# EAGLE design card_base (EAGLE 8.7.1)
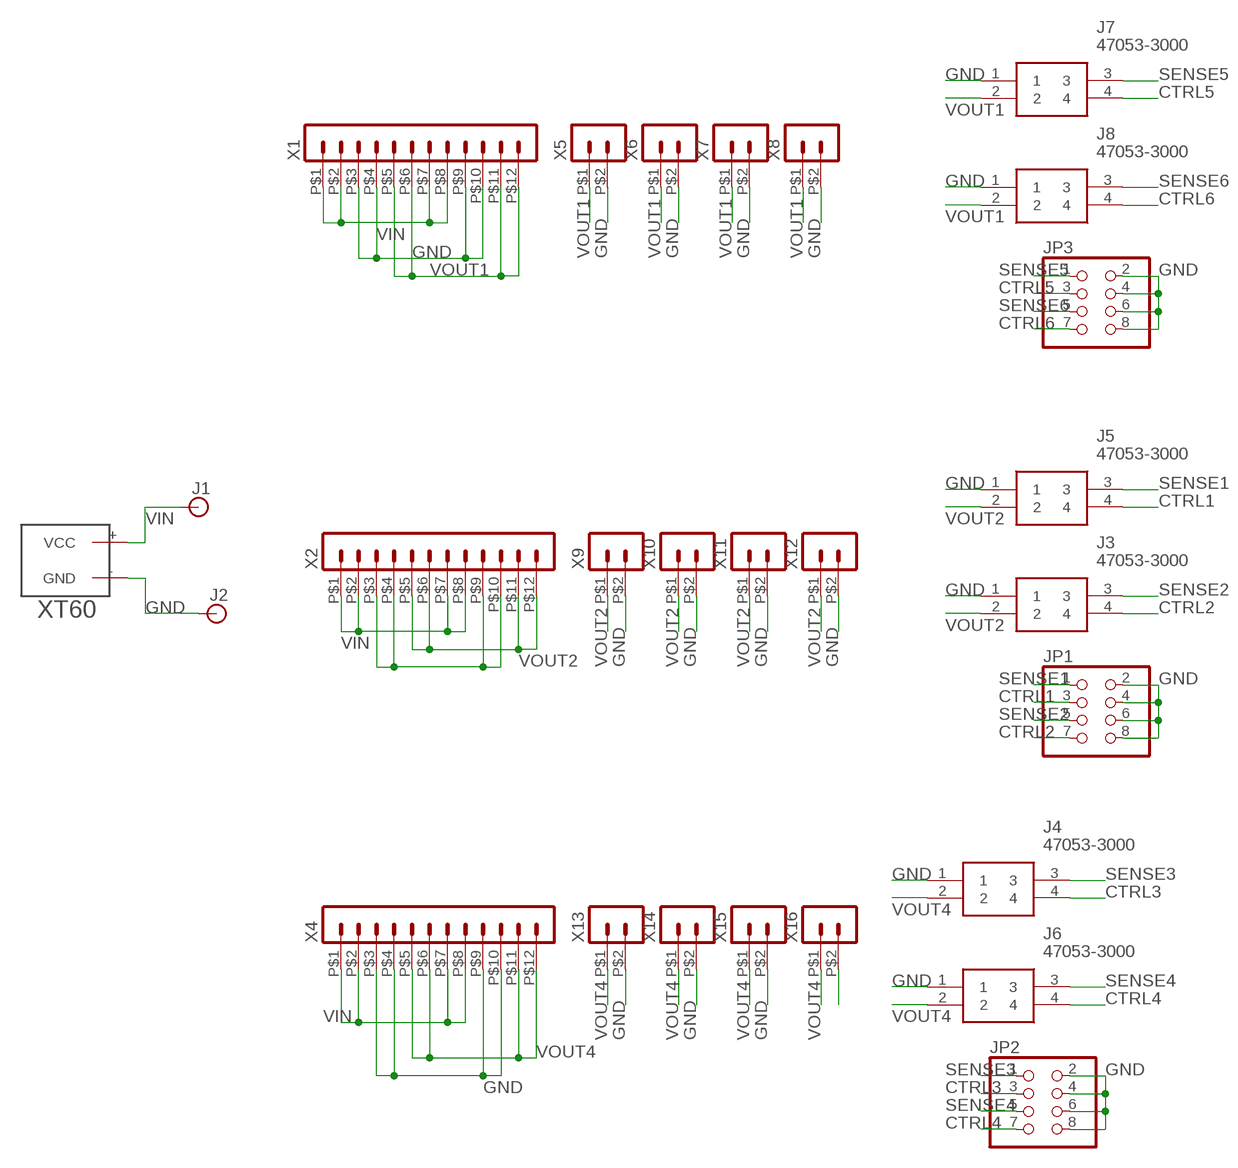
[diagram p0: schematic, sheet 1]

## Parts
J1  BANANA_CONN  [BANANA_CONN]
J2  BANANA_CONN  [BANANA_CONN]
J3  47053-3000  [470533000]
J4  47053-3000  [470533000]
J5  47053-3000  [470533000]
J6  47053-3000  [470533000]
J7  47053-3000  [470533000]
J8  47053-3000  [470533000]
JP1  PINHD-2X4  [2X04]
JP2  PINHD-2X4  [2X04]
JP3  PINHD-2X4  [2X04]
U$1  XT60  [XT60]
X1  HEADER_POS12_44432-1201  [44432-1201]
X2  HEADER_POS12_44432-1201  [44432-1201]
X4  HEADER_POS12_44432-1201  [44432-1201]
X5  HEADER_POS2_44914-0201  [44914-0201]
X6  HEADER_POS2_44914-0201  [44914-0201]
X7  HEADER_POS2_44914-0201  [44914-0201]
X8  HEADER_POS2_44914-0201  [44914-0201]
X9  HEADER_POS2_44914-0201  [44914-0201]
X10  HEADER_POS2_44914-0201  [44914-0201]
X11  HEADER_POS2_44914-0201  [44914-0201]
X12  HEADER_POS2_44914-0201  [44914-0201]
X13  HEADER_POS2_44914-0201  [44914-0201]
X14  HEADER_POS2_44914-0201  [44914-0201]
X15  HEADER_POS2_44914-0201  [44914-0201]
X16  HEADER_POS2_44914-0201  [44914-0201]

## Nets
CTRL1: J5.4 JP1.3
CTRL2: J3.4 JP1.7
CTRL3: J4.4 JP2.3
CTRL4: J6.4 JP2.7
CTRL5: J7.4 JP3.3
CTRL6: J8.4 JP3.7
GND: J2.P$1 J3.1 J4.1 J5.1 J6.1 J7.1 J8.1 JP1.2 JP1.4 JP1.6 JP1.8 JP2.2 JP2.4 JP2.6 JP2.8 JP3.2 JP3.4 JP3.6 JP3.8 U$1.-(GND) X1.P$3 X1.P$4 X1.P$9 X1.P$10 X2.P$3 X2.P$4 X2.P$9 X2.P$10 X4.P$3 X4.P$4 X4.P$9 X4.P$10 X5.P$2 X6.P$2 X7.P$2 X8.P$2 X9.P$2 X10.P$2 X11.P$2 X12.P$2 X13.P$2 X14.P$2 X15.P$2 X16.P$2
SENSE1: J5.3 JP1.1
SENSE2: J3.3 JP1.5
SENSE3: J4.3 JP2.1
SENSE4: J6.3 JP2.5
SENSE5: J7.3 JP3.1
SENSE6: J8.3 JP3.5
VIN: J1.P$1 U$1.+(VCC) X1.P$1 X1.P$2 X1.P$7 X1.P$8 X2.P$1 X2.P$2 X2.P$7 X2.P$8 X4.P$1 X4.P$2 X4.P$7 X4.P$8
VOUT1: J7.2 J8.2 X1.P$5 X1.P$6 X1.P$11 X1.P$12 X5.P$1 X6.P$1 X7.P$1 X8.P$1
VOUT2: J3.2 J5.2 X2.P$5 X2.P$6 X2.P$11 X2.P$12 X9.P$1 X10.P$1 X11.P$1 X12.P$1
VOUT4: J4.2 J6.2 X4.P$5 X4.P$6 X4.P$11 X4.P$12 X13.P$1 X14.P$1 X15.P$1 X16.P$1

## Library data of the parts
J1 J2 = SparkFun-Connectors:BANANA_CONN: Through-hole Banana Jack Basic PTH connection for banana jack plugs SparkFun Products: Multimeter Kit <https://www.sparkfun.com/products/retired/10956> Banana to Alligator Cable <https://www.sparkfun.com/products/retired/509> Banana to Alligator Coax Cable <https://www.sparkfun.com/products/retired/508> Banana to Banana Cable <https://www.sparkfun.com/products/retired/507> Banana to IC Hook Cables <https://www.sparkfun.com/products/retired/506>
J3-J8 = 47053-3000:47053-3000: Headers & Wire Housings 4 PIN HEADER WITH FR R WITH FRICTION LOCK Source: Datasheet <https://www.mouser.com/datasheet/2/276/0470533000_PCB_HEADERS-146177.pdf>; ALLIED_NUMBER: 71469769; ALLIED_PRICE-STOCK: https://www.alliedelec.com/molexincorporated-47053-3000/71469769/; DESCRIPTION: Headers & Wire Housings 4 PIN HEADER WITH FR R WITH FRICTION LOCK; HEIGHT: 9.84mm; MANUFACTURER_NAME: Molex; MANUFACTURER_PART_NUMBER: 47053-3000; MOUSER_PART_NUMBER: 538-47053-3000; MOUSER_PRICE-STOCK: https://www.mouser.co.uk/ProductDetail/Molex/47053-3000?qs=C09bn3Oxp5WWv2npicpAUw%3D%3D
JP1-JP3 = adafruit:PINHD-2X4: PIN HEADER
U$1 = XT60:XT60: XT60
X1 X2 X4 = con-molex-micro-fit-3_0:HEADER_POS12_?: Molex - Micro-Fit 3.0 Series connector, 3.00mm (0.118") pitch header, 12 positions.
X5-X16 = con-molex-micro-fit-3_0:HEADER_POS2_?: Molex - Micro-Fit 3.0 Series connector, 3.00mm (0.118") pitch header, 2 positions.

## Board
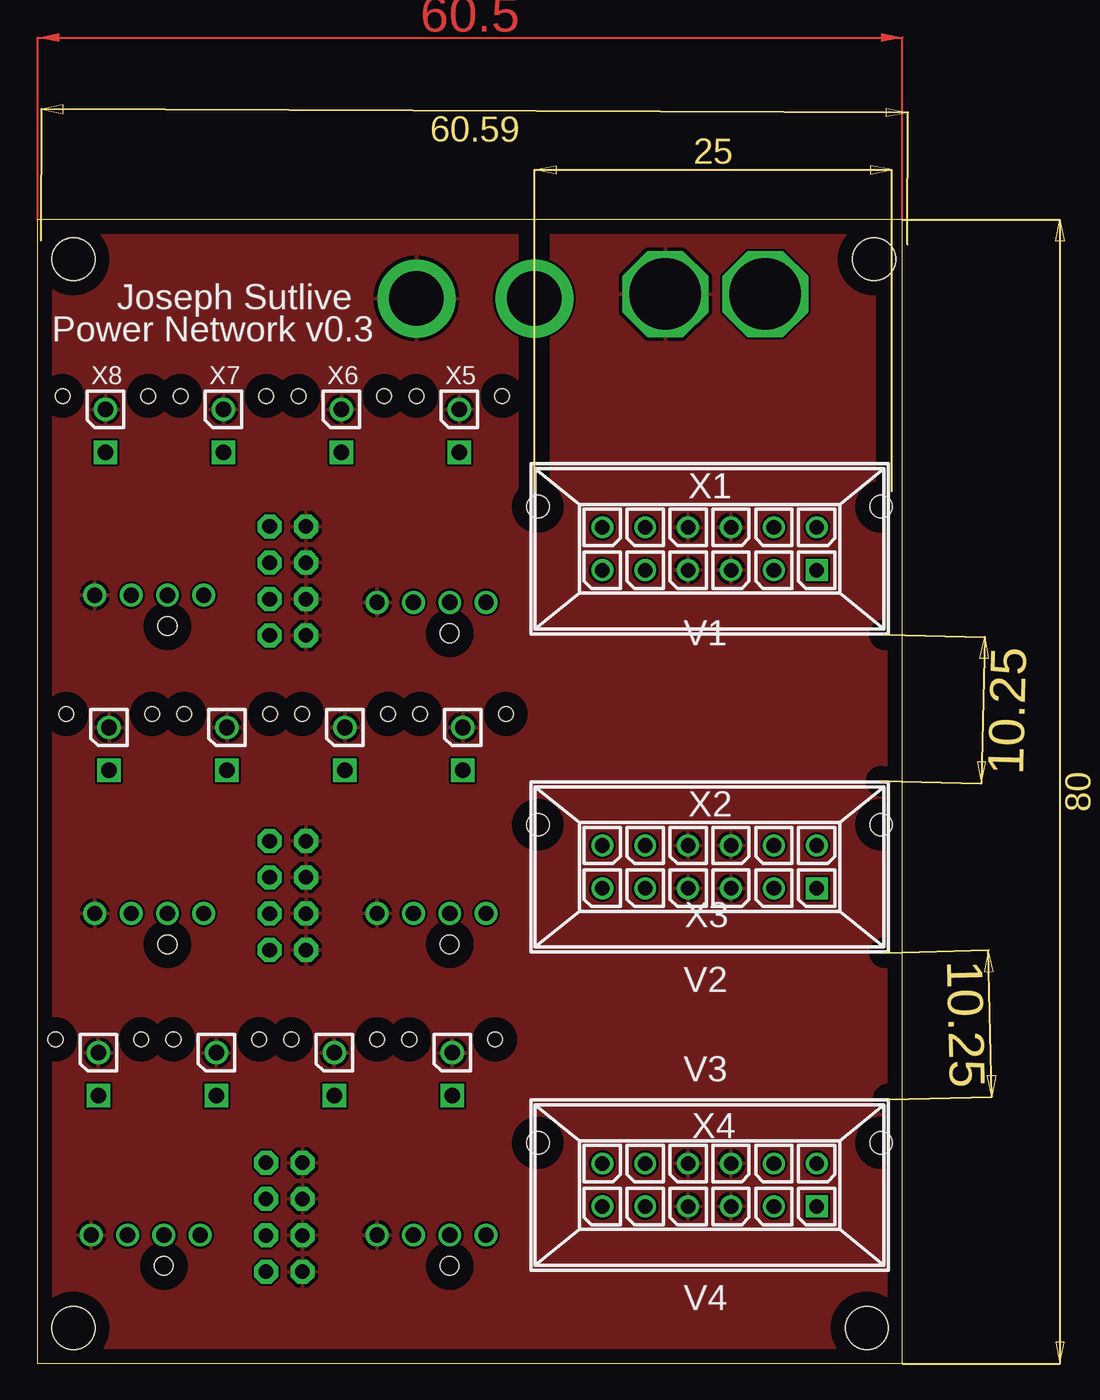
[diagram p1: board, top side]
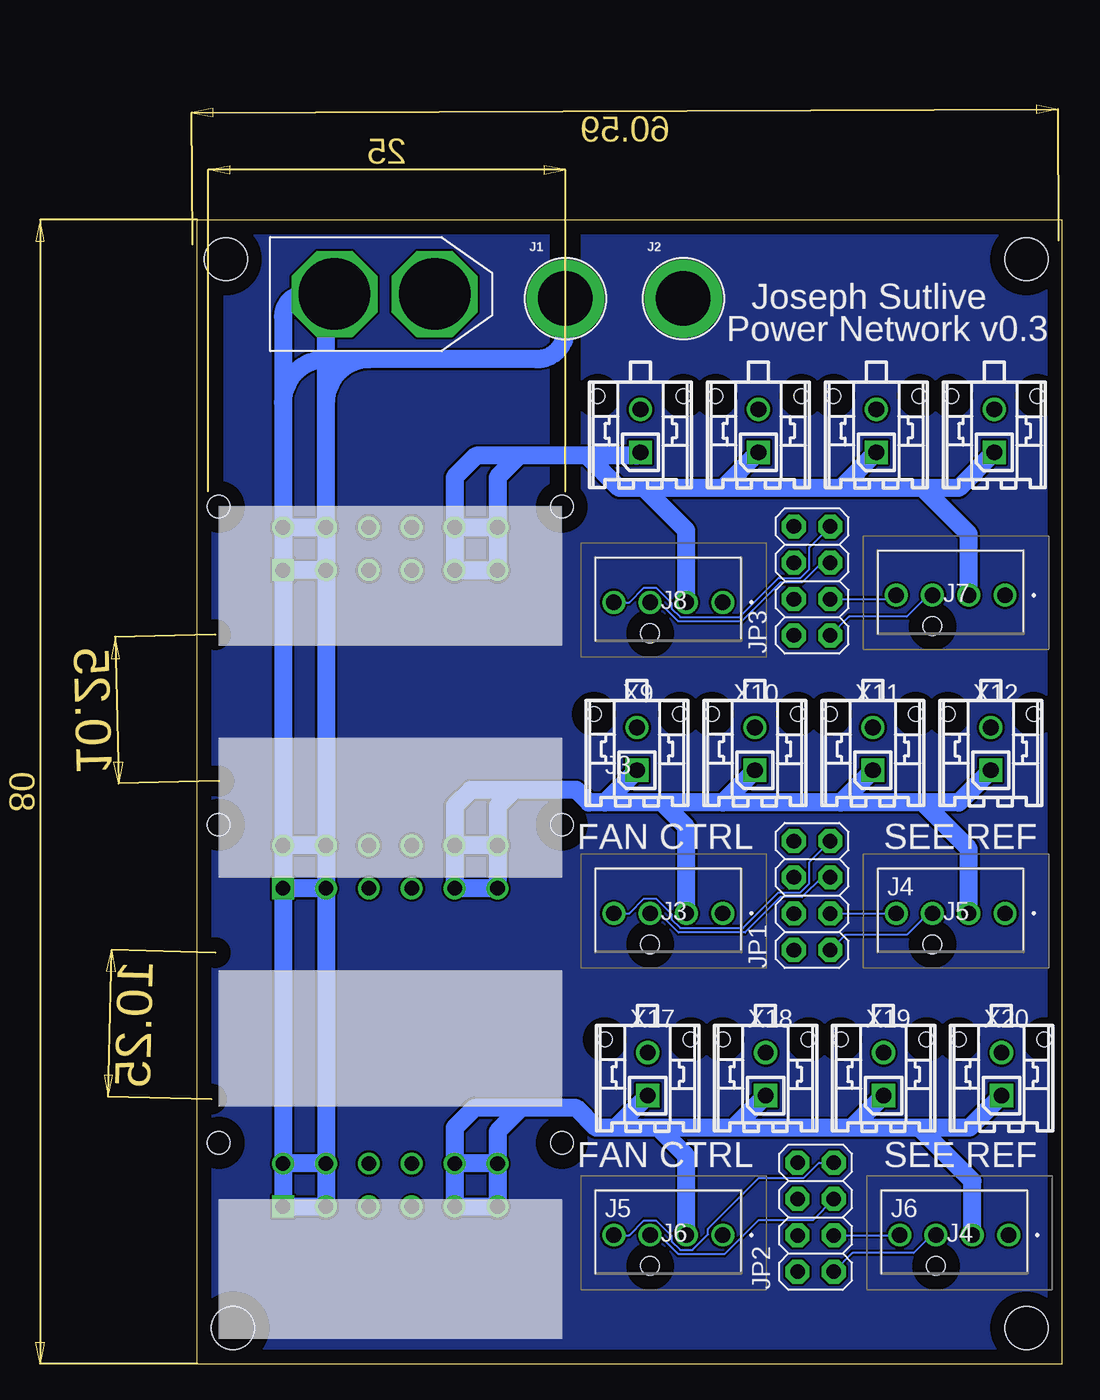
[diagram p2: board, bottom side, seen from below]

Size 60.5 x 80 mm. Coordinates in mm from the lower left corner, seen from the top.
Outline: 60.5,0 0,0 0,80 60.5,80 60.5,0
Copper layers (1*16): Top 0.035mm / dielectric 1.5mm / Bottom 0.035mm
Design rules "default": minimum track width 6mil, minimum drill 0.35mm, track to track 6mil, track to pad 6mil, pad to pad 6mil, via to via 6mil, smd to smd 6mil, copper to edge 40mil, drill to drill 6mil, minimum pad ring 10mil, minimum via ring 8mil, stop-mask expansion 4mil, vias tented up to drill 0mil, thermal gap 10mil
Holes 3 mm at 58,2.5 58.5,77.25 2.5,77.25 2.5,2.5

### Footprints (pad centres in the part's own frame; a part is rotated, then mirrored left to right if it is on the bottom)
BANANA_CONN = drill 3.81 pad 5.461: P$1 0,0
470533000 = drill 1.07 pad 1.605: 1 0,0; 2 -2.54,0; 3 -5.08,0; 4 -7.62,0 | hole 1.3: -5.08,-2.16
2X04 = drill 1.016 pad 1.676 octagon: 1 -3.81,-1.27; 2 -3.81,1.27; 3 -1.27,-1.27; 4 -1.27,1.27; 5 1.27,-1.27; 6 1.27,1.27; 7 3.81,-1.27; 8 3.81,1.27
XT60 = drill 5 octagon: + 4.5,0; - 11.5,0
44432-1201 = drill 1.02 square: P$1 7.5,-3 | drill 1.02: P$2 4.5,-3; P$3 1.5,-3; P$4 -1.5,-3; P$5 -4.5,-3; P$6 -7.5,-3; P$7 7.5,0; P$8 4.5,0; P$9 1.5,0; P$10 -1.5,0; P$11 -4.5,0; P$12 -7.5,0 | hole 1.57: -12,1.45; 12,1.45
44914-0201 = drill 1.09 square: P$1 0,0 | drill 1.09: P$2 0,3 | hole 1.02: 3,3.94; -3,3.94

### Placement (x,y rotation side)
J1  34.75,74.5 0 bottom
J2  26.5,74.5 0 bottom
J3  23.75,31.5 0 bottom
J4  3.75,9 0 bottom
J5  4,31.5 0 bottom
J6  23.75,9 0 bottom
J7  4,53.75 0 bottom
J8  23.75,53.25 0 bottom
JP1  17.5,32.75 90 bottom
JP2  17.25,10.25 90 bottom
JP3  17.5,54.75 90 bottom
U$1  55.4,74.81 0 bottom
X1  47,58.5 0 top
X2  47,36.25 0 top
X4  47,14 0 top
X5  29.5,63.75 0 bottom
X6  21.25,63.75 0 bottom
X7  13,63.75 0 bottom
X8  4.75,63.75 0 bottom
X9  21.5,41.5 0 bottom
X10  5,41.5 0 bottom
X11  29.75,41.5 0 bottom
X12  13.25,41.5 0 bottom
X13  29,18.75 0 bottom
X14  20.75,18.75 0 bottom
X15  4.25,18.75 0 bottom
X16  12.5,18.75 0 bottom

### Tracks (layer width: path | path; a pad name or v marks a point on that pad's centre or on a via)
CTRL1
  Bottom 0.152: JP1.3 11.64,31.48 J5.4
CTRL2
  Bottom 0.152: J3.4 30.29,31.5 29.26,32.53 28.4,32.53 27.32,31.45 27.32,31.07 26.72,30.47 22.32,30.47 19.84,32.95 18.33,32.95 17.7,33.58 17.7,35.09 JP1.7
CTRL3
  Bottom 0.152: JP2.3 11.39,8.98 J4.4
CTRL4
  Bottom 0.152: J6.4 30.29,9 29.26,10.03 28.4,10.03 27.32,8.95 27.32,8.57 26.72,7.97 25.86,7.97 24.78,9.05 24.78,9.43 21.21,12.99 18.08,12.99 17.01,14.06 JP2.7
CTRL5
  Bottom 0.152: JP3.3 11.89,53.48 J7.4
CTRL6
  Bottom 0.152: J8.4 30.29,53.25 29.26,54.28 28.4,54.28 27.32,53.2 27.32,52.82 26.72,52.22 22.57,52.22 19.84,54.95 18.33,54.95 17.7,55.58 17.7,57.09 JP3.7
GND
  pour Top: 0,79.75 0.25,0 60.5,0.25 60.5,80
N$1
  pour Bottom: 0,79.75 0.25,0 60.5,0 60.5,80
SENSE1
  Bottom 0.152: J5.3 9.5,31.08 9.8,31.08 10.88,30 15.17,30 JP1.1
SENSE2
  Bottom 0.152: JP1.5 16.83,34.02 18.2,32.65 19.71,32.65 22.2,30.16 26.84,30.16 28.18,31.5 J3.3
SENSE3
  Bottom 0.152: J4.3 9.25,8.58 9.55,8.58 10.38,7.75 14.67,7.75 JP2.1
SENSE4
  Bottom 0.152: JP2.5 17.45,10.05 21.24,10.05 23.63,7.66 26.84,7.66 28.18,9 J6.3
SENSE5
  Bottom 0.152: J7.3 9.5,53.33 9.8,53.33 10.88,52.25 14.92,52.25 JP3.1
SENSE6
  Bottom 0.152: JP3.5 16.83,56.02 18.2,54.65 19.71,54.65 22.45,51.91 26.84,51.91 28.18,53.25 J8.3
VIN
  Bottom 1.27: 54.5,67.25 54.5,73.25 arc90 52.94,74.81 U$1.+ arc-90 51.5,74.21 51.5,67.25 | 54.5,67.25 X1.P$7 | X1.P$7 X1.P$1 | X1.P$1 X2.P$7 | X2.P$7 X2.P$1 | X2.P$1 X4.P$7 | X4.P$7 X4.P$1 X4.P$2 X4.P$8 | X1.P$8 51.5,67.25 | X1.P$8 X1.P$2 | X1.P$2 X2.P$8 | X2.P$8 X2.P$2 | X2.P$2 X4.P$8 | X4.P$8 X4.P$7 | X2.P$2 X2.P$1 | X2.P$8 X2.P$7 | X1.P$2 X1.P$1 | X1.P$8 X1.P$7 | J1.P$1 34.75,72.25 arc90 36.75,70.25 48.5,70.25 | 48.5,70.25 arc-90 51.5,67.25 | 48.5,70.25 51.5,70.25 arc-90 54.5,67.25
VOUT1
  Bottom 1.27: X8.P$1 7.25,61.25 9.75,61.25 | 9.75,61.25 15.5,61.25 | 15.5,61.25 23.75,61.25 | 23.75,61.25 29.25,61.25 | 29.25,61.25 31,61.25 33.25,63.5 | 38,63.5 39.5,62 X1.P$12 | 33.25,63.5 38,63.5 | 38,63.5 41,63.5 42.5,62 X1.P$11 | X1.P$11 X1.P$5 X1.P$6 X1.P$12 | X1.P$12 X1.P$11 | X7.P$1 15.5,61.25 | X6.P$1 23.75,61.25 | X5.P$1 29.75,63.5 33.25,63.5 | J7.2 6.54,58.04 9.75,61.25 | J8.2 26.29,58.29 29.25,61.25
VOUT2
  Bottom 1.27: X10.P$1 7.25,39.25 9.75,39.25 | 38.36,40.14 33.99,40.14 33.11,39.25 32,39.25 | 9.75,39.25 15.5,39.25 | 15.5,39.25 23.75,39.25 | 23.75,39.25 28,39.25 | 28,39.25 32,39.25 | 38.36,40.14 39.5,39 X2.P$12 | 38.36,40.14 41.36,40.14 42.5,39 X2.P$11 | X2.P$11 X2.P$5 X2.P$6 X2.P$12 | X2.P$12 X2.P$11 | X11.P$1 32,39.25 | X9.P$1 23.75,39.25 | X12.P$1 15.5,39.25 | J3.2 26.29,37.54 28,39.25 | J5.2 6.54,36.04 9.75,39.25
VOUT4
  Bottom 1.27: X15.P$1 6.5,16.5 10,16.5 | 10,16.5 14.75,16.5 | 14.75,16.5 23,16.5 | 23,16.5 28.25,16.5 | 28.25,16.5 31.25,16.5 | 37.86,17.89 33.99,17.89 32.61,16.5 31.25,16.5 | 37.86,17.89 39.5,16.25 X4.P$12 | X4.P$12 X4.P$6 X4.P$5 X4.P$11 | 37.86,17.89 41.11,17.89 42.5,16.5 X4.P$11 | X4.P$12 X4.P$11 | X16.P$1 14.75,16.5 | X14.P$1 23,16.5 | X13.P$1 31.25,16.5 | J4.2 6.29,12.79 10,16.5 | J6.2 26.29,14.54 28.25,16.5
(copper drawn outside any net)
  shapes: Top area x1

### Text on the board
tNames: Joseph Sutlive | Power Network v0.3 | X8 | X7 | X6 | X5 | X1 | V1 | X2 | X3 | V2 | V3 | X4 | V4
bNames: Joseph Sutlive | Power Network v0.3 | X12 | X11 | X10 | X9 | J3 | FAN CTRL SEE REF | J4 | X20 | X19 | X18 | X17 | FAN CTRL SEE REF | J6 | J5